# EAGLE schematic board_template (EAGLE 8.1.0)
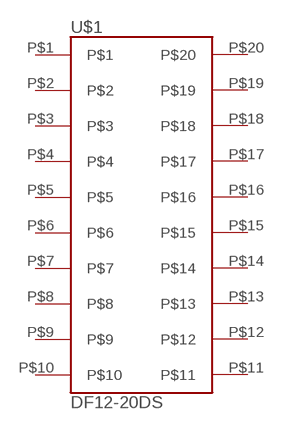
[diagram p0: schematic, sheet 1]

## Parts
U$1  DF12-20DS  [DF12(3.0)-20DS-0.5V(86)]
Unconnected: U$1.P$1 U$1.P$2 U$1.P$3 U$1.P$4 U$1.P$5 U$1.P$6 U$1.P$7 U$1.P$8 U$1.P$9 U$1.P$10 U$1.P$11 U$1.P$12 U$1.P$13 U$1.P$14 U$1.P$15 U$1.P$16 U$1.P$17 U$1.P$18 U$1.P$19 U$1.P$20

## Library data of the parts
U$1 = tribesat:DF12-20DS